# Altium schematic sheet 底板-交互.SchDoc
size A4; SheetNumber: 3; SheetTotal: 3
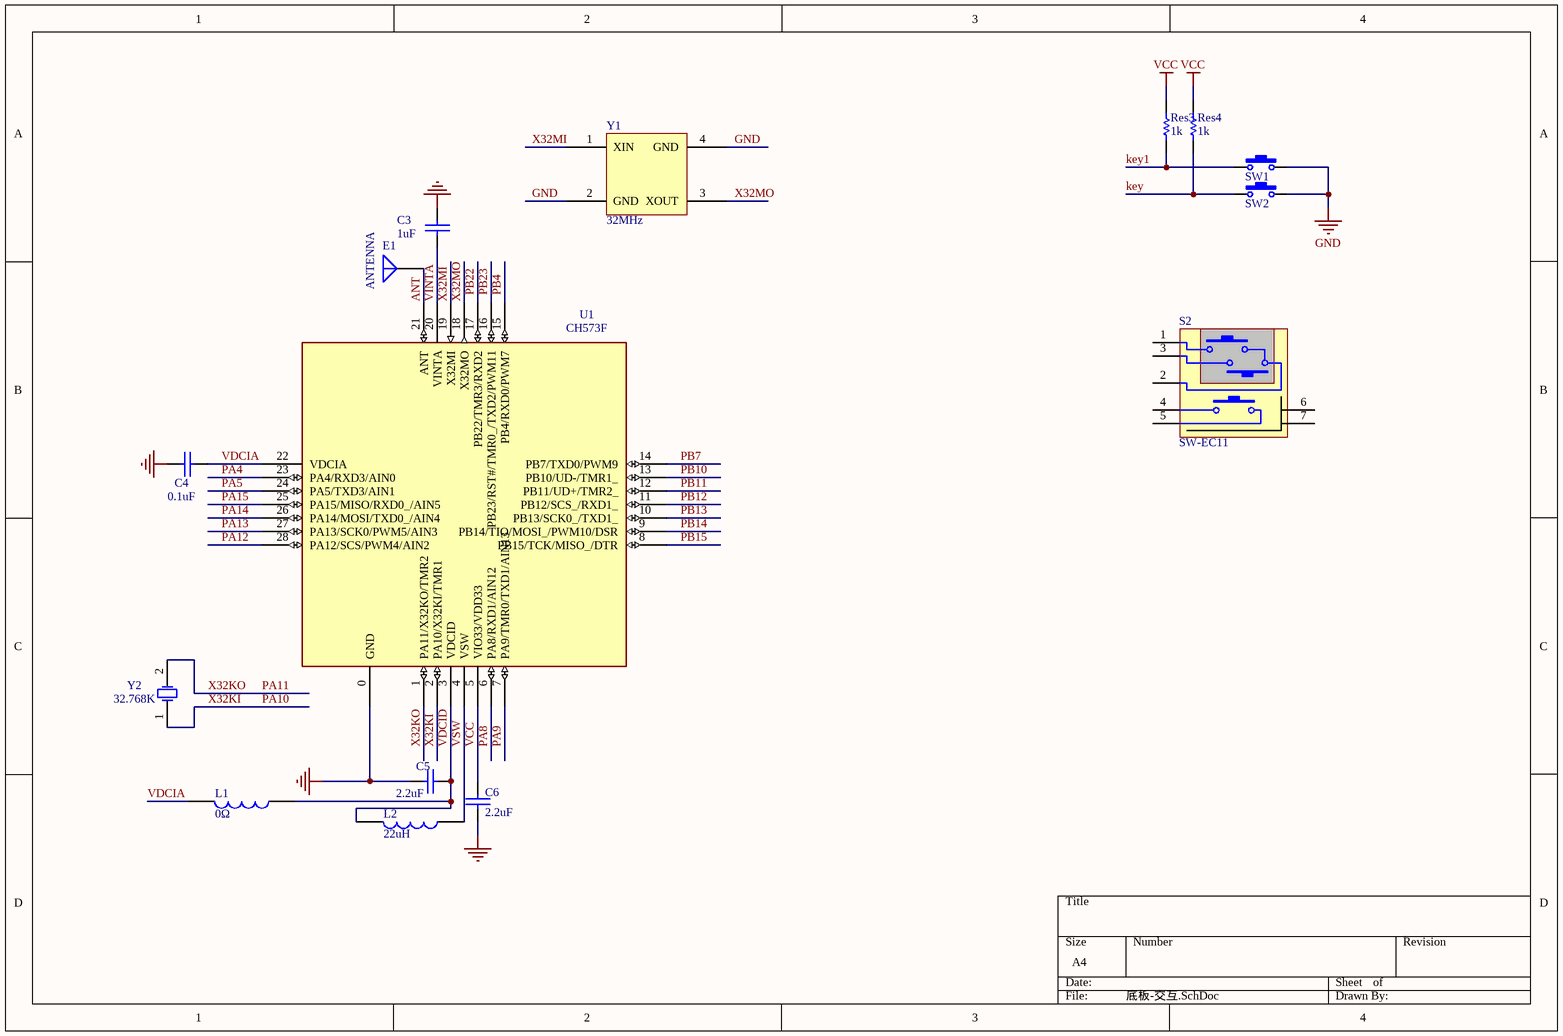
[diagram p0: 底板-交互.SchDoc]

## Parts
C3  1uF  [0402]
C4  0.1uF  [0402]
C5  2.2uF  [0402]
C6  2.2uF  [0402]
E1  ANTENNA  [ANT-F-1-2.4G-1.6]
L1  0Ω  [0603]
L2  22uH  [L2.2]
Res3  1k  [0805R]
Res4  1k  [0805R]
S2  SW-EC11  [EC11]
SW1  3x6x5  [SW 3*6*4.3-S-W]  (value not drawn)
SW2  3x6x5  [SW 3*6*4.3-S-W]  (value not drawn)
U1  CH573F  [QFN28_4X4]
Y1  32MHz  [3225]
Y2  32.768K  [fc-135]

## Nets
GND: C3.2 C4.2 C5.1 C6.1 SW1.2 SW2.2 U1.0(GND) Y1.2(GND) Y1.4(GND)
VCC: C6.2 Res3.1 Res4.1 U1.5(VIO33/VDD33)
ANT: E1.1(A) U1.21(ANT)
key: Res4.2 SW2.1
key1: Res3.2 SW1.1
PA4: U1.23(PA4/RXD3/AIN0)
PA5: U1.24(PA5/TXD3/AIN1)
PA8: U1.6(PA8/RXD1/AIN12)
PA9: U1.7(PA9/TMR0/TXD1/AIN13)
PA10: U1.2(PA10/X32KI/TMR1) Y2.1(OSC1)  [also labelled X32KI]
PA11: U1.1(PA11/X32KO/TMR2) Y2.2(OSC2)  [also labelled X32KO]
PA12: U1.28(PA12/SCS/PWM4/AIN2)
PA13: U1.27(PA13/SCK0/PWM5/AIN3)
PA14: U1.26(PA14/MOSI/TXD0_/AIN4)
PA15: U1.25(PA15/MISO/RXD0_/AIN5)
PB4: U1.15(PB4/RXD0/PWM7)
PB7: U1.14(PB7/TXD0/PWM9)
PB10: U1.13(PB10/UD-/TMR1_)
PB11: U1.12(PB11/UD+/TMR2_)
PB12: U1.11(PB12/SCS_/RXD1_)
PB13: U1.10(PB13/SCK0_/TXD1_)
PB14: U1.9(PB14/TIO/MOSI_/PWM10/DSR)
PB15: U1.8(PB15/TCK/MISO_/DTR)
PB22: U1.17(PB22/TMR3/RXD2)
PB23: U1.16(PB23/RST#/TMR0_/TXD2/PWM11)
VDCIA: C4.1 L1.2 U1.22(VDCIA)
VDCID: C5.2 L1.1 L2.2 U1.3(VDCID)
VINTA: C3.1 U1.20(VINTA)
VSW: L2.1 U1.4(VSW)
X32MI: U1.19(X32MI) Y1.1(XIN)
X32MO: U1.18(X32MO) Y1.3(XOUT)

Not connected (* = marked no-connect by the designer): S2 1 2 3 4 5 6 7

## Library data of the parts
C3-C6 = CAP: Capacitor
E1 = ANTENNA: Generic Antenna
L1 L2 = INDUCTOR
Res3 Res4 = RES
S2 = SW-EC11: 旋转编码开关; 联系卖家，免费查找封装: 唯一出售店铺网址https://shop463601444.taobao.com
SW1 SW2 = TSW 3x6: 3x6轻触开关; 联系卖家，免费查找封装: 唯一出售店铺网址https://shop463601444.taobao.com; BOM名称: 3x6轻触开关
U1 = CH573F: RISC-V MCU with BLE/USB/ADC/SPI/4*UART
Y1 = 晶体
Y2 = XTAL: Crystal Oscillator; Published: 8-Jun-2000; LatestRevisionDate: 17-Jul-2002; LatestRevisionNote: Re-released for DXP Platform.; PackageReference: R38; Publisher: Altium Limited; PackageDescription: Crystal, Thru-Hole; 2 Leads; Body 3.1 x 8.2 mm (Dia.xH)